# EAGLE board PMTHead (EAGLE 7.7.0)
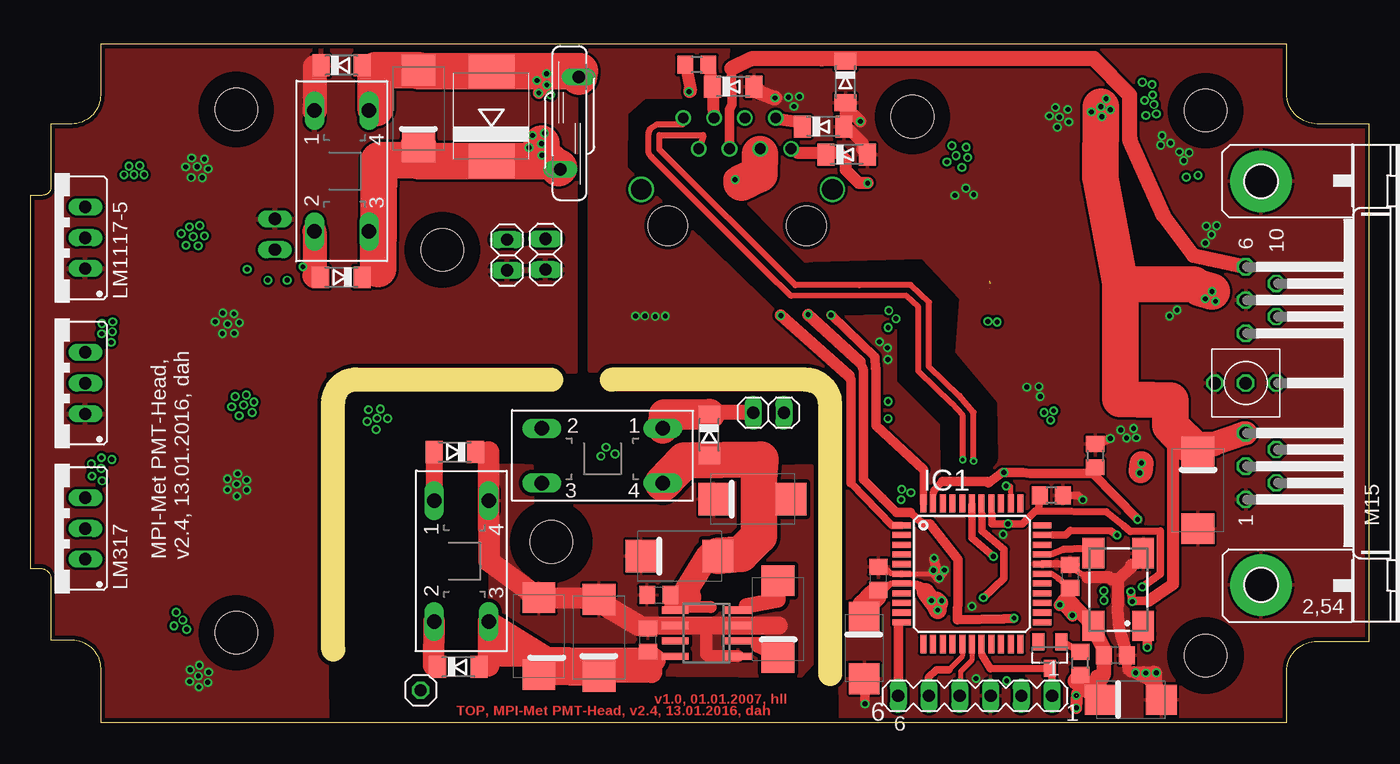
[diagram p4: board, top side]
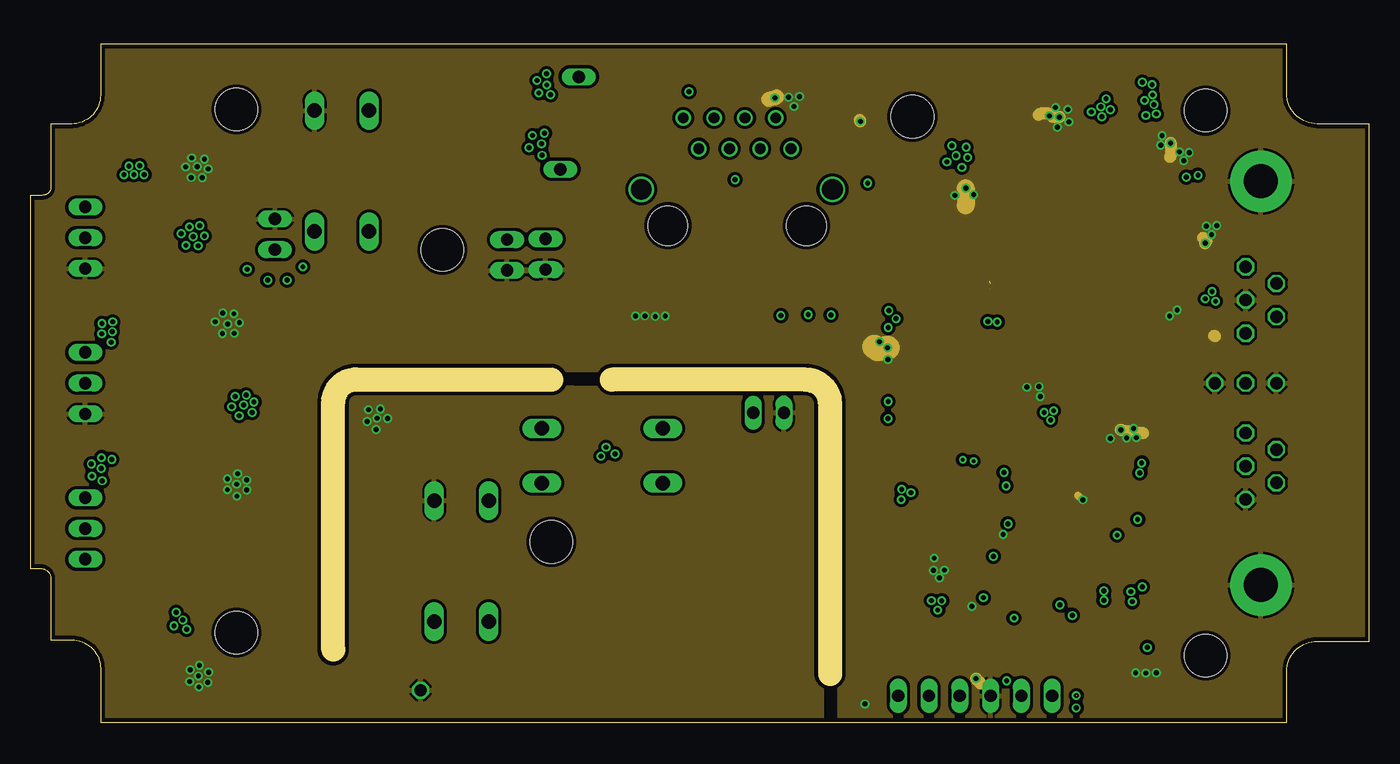
[diagram p5: board, inner layer layer_gnd]
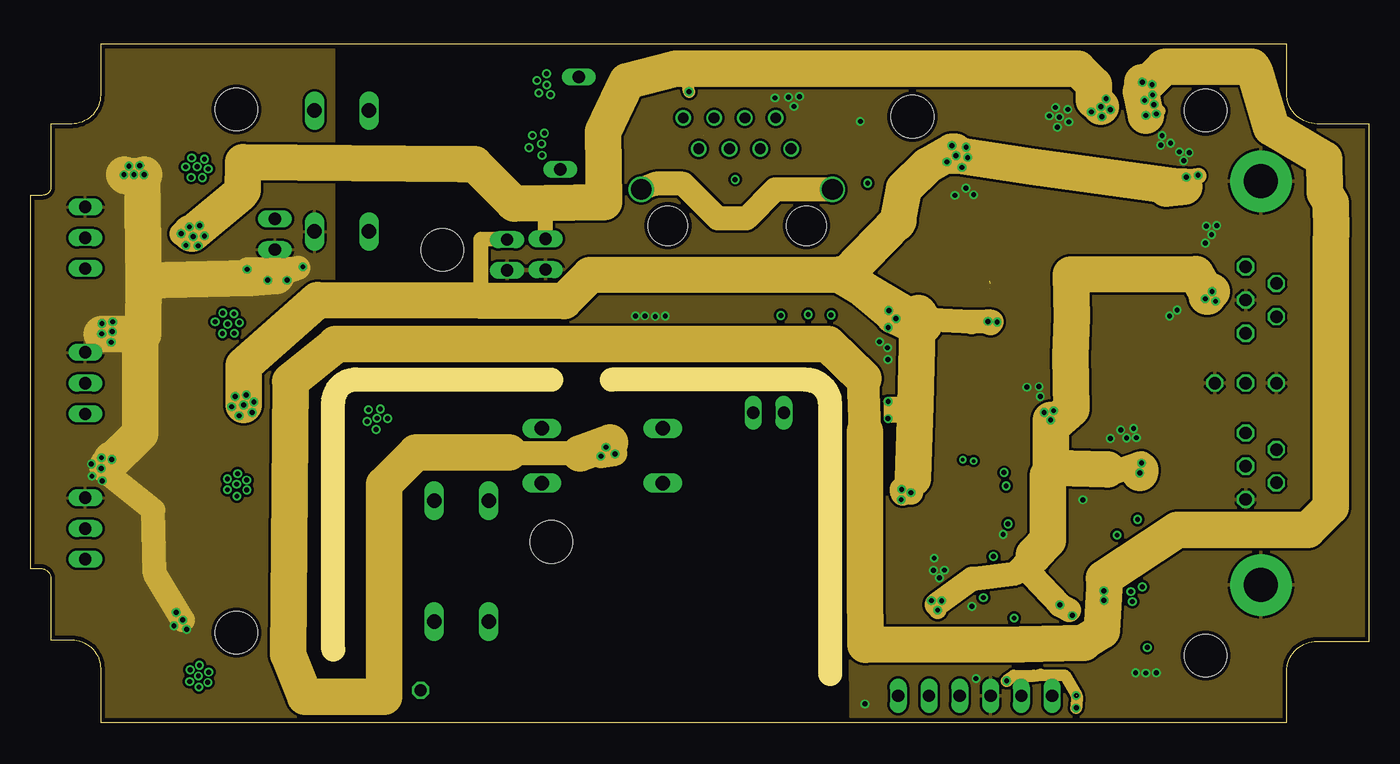
[diagram p6: board, inner layer layer_pwr]
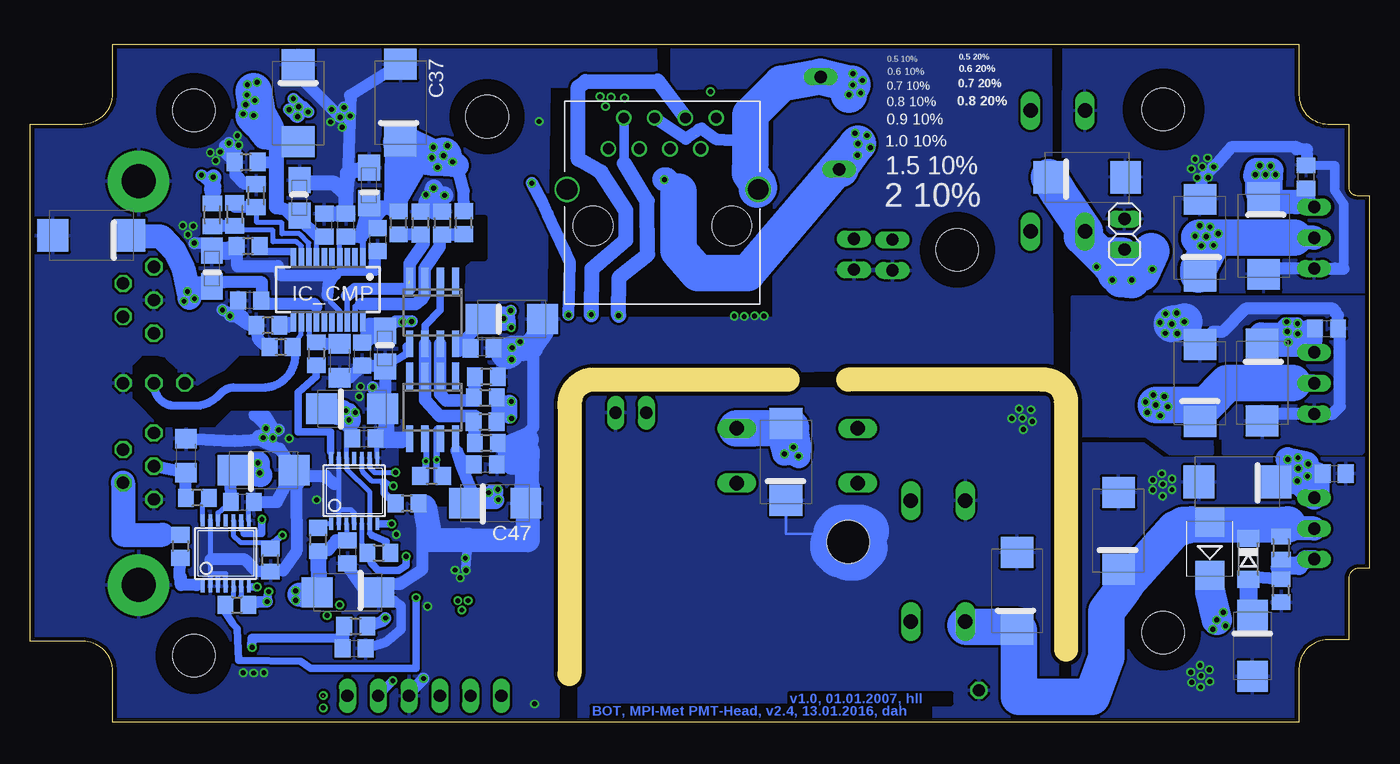
[diagram p7: board, bottom side, seen from below]

Size 110.5 x 56 mm. Coordinates in mm from the lower left corner, seen from the top.
Outline: 25,6 25,26.5 arc-90 27,28.3 43,28.3
Outline: 64.1,28.3 arc-90 66,26.1 66,4
Outline: 64,28.3 48,28.3
Outline: 0,43.5 0,12.7 0.9,12.7 arc-90 1.7,11.8 1.7,6.8 3.4,6.8 arc-90 5.8,4.4 5.8,0 103.7,0 103.7,4.2 arc-90 106.2,6.7 110.5,6.7 110.5,49.4 106.2,49.4 arc-90 103.7,51.9 103.7,56 5.8,56 5.8,51.8 arc-90 3.4,49.4 1.7,49.4 1.7,44.2 arc-90 1,43.5 0,43.5
Copper layers (1+2*15+16): Top 0.035mm / dielectric 0.38mm / layer_gnd 0.035mm / dielectric 0.71mm / layer_pwr 0.035mm / dielectric 0.38mm / Bottom 0.035mm
Design rules "PCB-POOL Standard_ML4": minimum track width 0.15mm, minimum drill 0.3mm, track to track 0.15mm, track to pad 0.15mm, pad to pad 0.15mm, via to via 0.15mm, smd to smd 0.15mm, copper to edge 0.3mm, drill to drill 0.2mm, minimum pad ring 0.2mm, minimum via ring 0.15mm, stop-mask expansion 0.075mm, vias tented up to drill 0mil, thermal gap 0.2mm
Net classes: 0 default: width 0.2 mm, clearance 0.205 mm; 1 power: width 1.4 mm, clearance 0.2 mm; 2 hpower: width 3 mm, clearance 0.2 mm
Holes 3.5 mm at 17,7.4 17,50.6 97,5.5 97,50.5 43,14.9 34,39 72.8,50
tRestrict: area 14,4.4 to 20,10.4; area 94,47.5 to 100,53.5; area 94,2.5 to 100,8.5; area 31,36 to 37,42; area 40,11.9 to 46,17.9; area 14,47.6 to 20,53.6; area 69.8,47 to 75.8,53
bRestrict: area 14,47.6 to 20,53.6; area 14,4.4 to 20,10.4; area 31,36 to 37,42; area 94,47.5 to 100,53.5; area 94,2.5 to 100,8.5; area 69.8,47 to 75.8,53; area 88.4,24.5 to 102,30.2; area 72.3,18 to 85.4,41.7

## Footprints (pad centres in the part's own frame; a part is rotated, then mirrored left to right if it is on the bottom)
D/7343-31R = smd 2.55 x 2.7: + 3.175,0; - -3.175,0
C0805 = smd 1.3 x 1.5: 1 -0.95,0; 2 0.95,0
A/3216-18W = smd 2.15 x 1.8: + 1.475,0; - -1.475,0
C/6032-28R = smd 2.55 x 2.5: + 2.525,0; - -2.525,0
C1206 = smd 1.6 x 1.8: 1 -1.4,0; 2 1.4,0
SMC = smd 2.8 x 3.8: A 3.7,0; C -3.7,0
SOD80C = smd 1.4 x 1.8: A 1.7,0; C -1.7,0
SMB = smd 2.4 x 2.4: A 2.2,0; C -2.2,0
MINIMELF = smd 1.4 x 1.8: A 1.7,0; C -1.7,0
SOT23 = smd 1 x 1.4: 1 -0.95,-1.1; 2 0.95,-1.1; 3 0,1.1
TQFP44 = smd 1.5 x 0.5: 1 -5.8,4; 2 -5.8,3.2; 3 -5.8,2.4; 4 -5.8,1.6; 5 -5.8,0.8; 6 -5.8,0; 7 -5.8,-0.8; 8 -5.8,-1.6; 9 -5.8,-2.4; 10 -5.8,-3.2; 11 -5.8,-4; 23 5.8,-4; 24 5.8,-3.2; 25 5.8,-2.4; 26 5.8,-1.6; 27 5.8,-0.8; 28 5.8,0; 29 5.8,0.8; 30 5.8,1.6; 31 5.8,2.4; 32 5.8,3.2; 33 5.8,4 | smd 0.5 x 1.5: 12 -4,-5.8; 13 -3.2,-5.8; 14 -2.4,-5.8; 15 -1.6,-5.8; 16 -0.8,-5.8; 17 0,-5.8; 18 0.8,-5.8; 19 1.6,-5.8; 20 2.4,-5.8; 21 3.2,-5.8; 22 4,-5.8; 34 4,5.8; 35 3.2,5.8; 36 2.4,5.8; 37 1.6,5.8; 38 0.8,5.8; 39 0,5.8; 40 -0.8,5.8; 41 -1.6,5.8; 42 -2.4,5.8; 43 -3.2,5.8; 44 -4,5.8
QSOP20 = smd 0.45 x 1.5: 1 -2.857,-2.69; 2 -2.223,-2.69; 3 -1.587,-2.69; 4 -0.953,-2.69; 5 -0.318,-2.69; 6 0.318,-2.69; 7 0.953,-2.69; 8 1.587,-2.69; 9 2.223,-2.69; 10 2.857,-2.69; 11 2.857,2.69; 12 2.223,2.69; 13 1.587,2.69; 14 0.953,2.69; 15 0.318,2.69; 16 -0.318,2.69; 17 -0.953,2.69; 18 -1.587,2.69; 19 -2.223,2.69; 20 -2.857,2.69
SOP08@1 = smd 0.6 x 2.2: 1 -1.905,-2.6; 2 -0.635,-2.6; 3 0.635,-2.6; 4 1.905,-2.6; 5 1.905,2.6; 6 0.635,2.6; 7 -0.635,2.6; 8 -1.905,2.6
TSSOP14 = smd 0.305 x 0.991: 1 -1.905,-2.718; 2 -1.27,-2.718; 3 -0.635,-2.718; 4 0,-2.718; 5 0.635,-2.718; 6 1.27,-2.718; 7 1.905,-2.718; 8 1.905,2.718; 9 1.27,2.718; 10 0.635,2.718; 11 0,2.718; 12 -0.635,2.718; 13 -1.27,2.718; 14 -1.905,2.718
82721K = drill 1.194 long: 1 -4.993,-2.254; 2 4.993,-2.254; 3 4.993,2.254; 4 -4.993,2.254
317TS = drill 1.016 long: 1 -2.54,-2.54; 2 0,-2.54; 3 2.54,-2.54
317TS' = drill 1.016 long: 1_GND -2.54,-2.54; 2_OUT 0,-2.54; 3_IN 2.54,-2.54
SOP08 = smd 0.6 x 2.2: 1 -1.905,-2.6; 2 -0.635,-2.6; 3 0.635,-2.6; 4 1.905,-2.6; 5 1.905,2.6; 6 0.635,2.6; 7 -0.635,2.6; 8 -1.905,2.6
MA06-1 = drill 1.016 long: 1 -6.35,0; 2 -3.81,0; 3 -1.27,0; 4 1.27,0; 5 3.81,0; 6 6.35,0
SM77H = smd 2.5 x 1.8: 1 -3,-2.05; 2 3,-2.05; 3 3,2.05; 4 -3,2.05
R0805 = smd 1.3 x 1.5: 1 -0.95,0; 2 0.95,0
S10K11 = drill 1.016 long: 1 -0.762,-3.81; 2 0.762,3.81
M0805 = smd 1.3 x 1.6: 1 -0.95,0; 2 0.95,0
CAT6 = drill 0.889: 1 -4.445,5.08; 2 -3.175,7.62; 3 -1.905,5.08; 4 -0.635,7.62; 5 0.635,5.08; 6 1.905,7.62; 7 3.175,5.08; 8 4.445,7.62 | drill 1.7: P$1 7.913,1.734; P$2 -7.862,1.721 | hole 3.251: -5.715,-1.27; 5.715,-1.27
1X01 = drill 1.016 octagon: 1 0,0
M15HP = drill 1.016 octagon: 1 -9.601,1.27; 2 -6.858,1.27; 3 -4.115,1.27; 4 4.115,1.27; 5 6.858,1.27; 6 9.601,1.27; 7 -8.23,-1.27; 8 -5.486,-1.27; 9 5.486,-1.27; 10 8.23,-1.27; COAX 0,1.27; COAX_GND1 0,3.81; COAX_GND2 0,-1.27 | drill 2.8 pad 5.08: G1 -16.662,0; G2 16.662,0
1X02 = drill 1.016 long: 1 -1.27,0; 2 1.27,0

## Placement (x,y rotation side)
C1  100uF  [D/7343-31R]  23.28,44.99 180 bottom
C2  100uF  [D/7343-31R]  32.05,50.67 270 top
C3  100nF  [C0805]  2.89,20.53 0 bottom
C4  100nF  [C0805]  72.94,21.3 180 bottom
C5  47uF  [D/7343-31R]  61.71,8.52 270 top
C6  100nF  [C0805]  5.21,45.03 90 bottom
C7  100uF  [D/7343-31R]  29.06,10.85 270 bottom
C8  100uF  [D/7343-31R]  8.71,40.16 90 bottom
C9  1uF  [A/3216-18W]  82.54,44.33 270 bottom
C10  1uF  [A/3216-18W]  81.22,30.85 90 bottom
C11  100uF  [D/7343-31R]  10.89,19.84 0 bottom
C12  100uF  [D/7343-31R]  20.69,15.81 270 bottom
C13  10uF  [C/6032-28R]  9.63,6.31 90 bottom
C14  100nF  [C0805]  3.53,32.51 0 bottom
C15  100uF  [D/7343-31R]  8.84,28.04 90 bottom
C16  100uF  [D/7343-31R]  13.97,28 270 bottom
C17  100uF  [D/7343-31R]  13.97,40 270 bottom
C18  100nF  [C0805]  50.98,6.79 90 top
C19  47uF  [D/7343-31R]  53.59,13.72 180 top
C20  100uF  [D/7343-31R]  59.61,18.43 180 top
C21  100uF  [D/7343-31R]  48.14,21.5 270 bottom
C22  47uF  [D/7343-31R]  46.94,6.99 270 top
C23  100uF  [D/7343-31R]  41.97,7.12 270 top
C24  100nF  [C0805]  51.86,10.51 0 top
C25  100nF  [C0805]  89.54,5.52 180 top
C26  820nF  [C1206]  97.65,22.02 90 bottom
C27  100nF  [C0805]  85.81,12.05 270 top
C28  100nF  [C0805]  70,11.89 90 top
C29  100nF  [C0805]  93,18.2 0 bottom
C30  100nF  [C0805]  84.33,14.07 270 bottom
C31  100nF  [C0805]  82.96,23.43 0 bottom
C32  10nF  [C0805]  83.11,30.41 270 bottom
C33  10nF  [C0805]  81.83,39.85 270 bottom
C34  10nF  [C0805]  84.45,41.05 90 bottom
C35  10nF  [C0805]  86.23,41.04 90 bottom
C36  10nF  [C0805]  92.39,34.83 180 bottom
C37  100uF  [D/7343-31R]  79.95,51.15 270 bottom
C38  10uF  [C/6032-28R]  91.25,20.82 180 bottom
C39  10uF  [C/6032-28R]  83.94,25.88 180 bottom
C40  10uF  [C/6032-28R]  84.29,10.73 0 bottom
C41  10uF  [C/6032-28R]  90.82,1.86 180 top
C42  10uF  [C/6032-28R]  68.83,6.13 90 top
C43  100uF  [D/7343-31R]  88.39,51.11 90 bottom
C44  1uF  [A/3216-18W]  95.51,37.47 270 bottom
C45  1uF  [A/3216-18W]  88.28,43.29 90 bottom
C46  10uF  [C/6032-28R]  70.76,33.29 180 bottom
C47  10uF  [C/6032-28R]  72.13,18.09 180 bottom
C48  100nF  [C0805]  73.22,30.88 180 bottom
C49  100uF  [D/7343-31R]  105.46,40.2 0 bottom
C50  100uF  [D/7343-31R]  96.36,19.16 90 top
C51  100nF  [C0805]  83.78,6.11 0 bottom
COLP  820nF  [C1206]  84.98,29.84 270 bottom
D2  [SMC]  38.06,50.03 90 top
D3  [SOD80C]  25.67,36.74 180 top
D4  [SOD80C]  25.69,54.24 0 top
D5  [SMB]  13.15,14.32 90 bottom
D6  5.6V  [MINIMELF]  65.43,49.18 0 top
D7  [SOD80C]  35.33,4.58 0 top
D8  [SOD80C]  35.04,22.32 180 top
D9  [SOD80C]  56.03,23.73 270 top
D10  [SOT23]  84.14,5.56 180 top
D11  [SOD80C]  9.98,13.49 270 bottom
D12  5.6V  [MINIMELF]  67.38,46.87 0 top
D13  5.6V  [MINIMELF]  67.28,52.86 270 top
D14  5.6V  [MINIMELF]  58.01,52.48 0 top
IC1  PIC16F877PT  [TQFP44]  77.71,12.26 0 top
IC_CMP  [QSOP20]  85.92,35.72 180 bottom
IC_DRV  SN65LVDS100  [SOP08@1]  77.3,26.01 180 bottom
IC_FLIP  MC100LVEL51  [SOP08@1]  77.3,33.84 180 bottom
IC_R2_GAIN  100k  [TSSOP14]  94.37,13.94 0 bottom
IC_R2_OFFS  10k  [TSSOP14]  83.77,19.11 0 bottom
L1  CMC_1MH_2A_45MOHM  [82721K]  25.7,45.51 270 top
L2  CMC_1MH_2A_45MOHM  [82721K]  35.59,13.32 270 top
L3  CMC_1MH_2A_45MOHM  [82721K]  47.22,22.01 180 top
LM317  5.3V  [317TS]  2,16 90 top
LM1117-3.3  3.3V  [317TS']  2,28 90 top
LM1117-5  5.0V  [317TS']  2,40 90 top
LM2663  lm2663  [SOP08]  55.82,7.36 90 top
PROGRAMMIER_INTERFACE  [MA06-1]  77.98,2.19 180 top
QC1  5V 20MHz  [SM77H]  89.79,10.96 90 top
R1  470  [R0805]  86.65,4.88 90 top
R1_GAIN  10k  [R0805]  98.11,14.53 270 bottom
R1_OFFS  2M2  [R0805]  86.74,15.09 90 bottom
R2  10k  [R0805]  90.68,13.39 90 bottom
R3  4k7  [R0805]  92.69,46.26 0 bottom
R4  82.5  [R0805]  76.51,41.21 270 bottom
R5  200k  [R0805]  90.89,32.77 180 bottom
R6  390  [R0805]  96.71,18.53 180 bottom
R7  82.5  [R0805]  78.3,41.22 270 bottom
R8  127  [R0805]  80.1,41.23 90 bottom
R9  127  [R0805]  74.72,41.25 90 bottom
R10  82.5  [R0805]  72.87,23.05 180 bottom
R11  82.5  [R0805]  72.87,28.53 180 bottom
R12  127  [R0805]  72.97,24.81 0 bottom
R13  127  [R0805]  72.94,26.81 0 bottom
R14  4k7  [R0805]  92.52,39.32 0 bottom
R15  10k  [R0805]  79.41,18.07 180 bottom
R16  S10K11  [S10K11]  44.51,49.47 0 top
R17  100  [R0805]  77.37,20.35 0 bottom
R19  120  [M0805]  7.29,14.39 90 bottom
R20  390  [R0805]  7.27,10.87 90 bottom
R27  1k  [M0805]  95.47,41.9 270 bottom
R28  1k  [M0805]  93.63,41.93 90 bottom
R29  1k  [M0805]  91.87,43.49 90 bottom
R35  470  [R0805]  83.64,7.94 0 bottom
R_CS0  4k7  [R0805]  93.45,9.7 0 bottom
R_CS1  4k7  [R0805]  81.73,13.99 0 bottom
R_P1  4k7  [R0805]  87.88,22.02 270 top
R_P2  4k7  [R0805]  84.27,18.74 180 top
R_P3  4k7  [R0805]  55.01,54.29 180 top
R_TERM  49.9  [R0805]  89.8,30.99 0 bottom
RJ45  [CAT6]  58.34,42.27 0 bottom
ROLP  100  [R0805]  86.89,30.43 270 bottom
SHIELDG  [1X01]  32.21,2.65 0 top
SUBD  [M15HP]  101.57,28 90 top
TP_12V  [1X02]  20.2,40.29 270 bottom
TP_+3.3V  [1X02]  39.35,38.58 90 top
TP_+5V  [1X02]  42.52,38.64 90 top
TP_-5V  [1X02]  60.93,25.56 180 top

## Tracks (layer width: path | path; a pad name or v marks a point on that pad's centre or on a via)
12V_VON_DAQ  (via drill 0.4)
  Top 1: 28.7,37.4 28.02,37.4 D3.C | 28.79,46.42 28.05,40.6 L1.3 | v42.19,47.76 42.19,48.39 v42.43,48.63 41.62,48.63 v41.44,48.45 41.44,47.72 v41.16,47.44 | 42.19,46.98 42.19,46.86 v42.24,46.81
  Top 2: RJ45.3 60.2,46.91 | 58.7,44.54 58.3,44.76 v58.17,44.81
  Top 3: 28.7,37.4 28.79,46.42 32.09,46.42 32,47.5 C2.+ 32.05,46.33 D2.C 42.84,46.33 | 42.84,46.33 43.61,45.73 43.62,45.78 | v42.19,47.76 42.19,46.98 42.84,46.33 | 60.2,46.91 60.17,45.24 59.15,44.74 58.7,44.54
  Bottom 2: v58.17,44.81 58,44.81 57.02,43.83
  Bottom 3: 43.65,45.66 R16.1 42.3,47.65 v42.19,47.76 51.3,37.09 55.4,37.09 57.02,38.96 57.02,43.83
+3V3  (via drill 0.4)
  layer_pwr 0.5: 76.07,47.1 v76.07,47.6 | v75.65,46.26 75.65,45.62 75.55,45.52 76.2,45.52 76.2,45.53 76.6,45.53 v76.88,45.81 | 71.24,33.58 71.43,33.87 v70.85,33.99
  layer_pwr 0.635: 72.84,20.14 72.92,20.12 72.92,20 | v76.4,46.79 76.42,46.79 76.42,46.84
  layer_pwr 0.7: 73.57,26.5 70.8,26.51 v70.78,25.06 72.4,25.07 72.4,25.67 71.23,25.67 71.27,26.43 73.74,26.43 73.06,26.19
  layer_pwr 0.8: v70.8,26.48 73.57,26.5
  layer_pwr 1.25: TP_+3.3V.2 37.18,39.87 37.15,34.82
  layer_pwr 1.3: v95.4,45 96.4,45.12 94.57,44.22
  layer_pwr 2: 71.24,33.58 70.8,33.37 v71.45,33.32 | 79.08,33.01 79.26,32.93 v79.03,33.1 79.33,33.08 77.71,33.03 73.64,33.27 | v72.68,18.96 72.64,19.72 72.92,20 71.98,18.87 v71.92,19.24
  layer_pwr 3: v17.6,26.2 17.62,29.45 23.71,34.84 37.15,34.82 44.04,34.77 46.21,36.94 66.74,36.98 73.76,32.79 | 73.76,32.79 73.2,32.64 | 73.2,32.64 71.24,33.58 | 72.84,20.14 73.06,26.19 73.2,32.64 | v70.85,33.99 67.31,36.98 71.66,41.4 71.38,41.11 71.57,41.26 72.12,44.06 74.03,45.97 76.07,47.1 76.02,47.07 76.3,47.11 v76.4,46.79 | 94.57,44.22 95.24,44.22 93.77,44.04 94.93,44.17 82.67,45.86 76.42,46.84 76.17,46.88 | 73.64,33.27 73.28,33.8 C46.+ 73.76,32.81 73.76,32.79
  Bottom 0.4: IC_CMP.4 84.97,39.58 C34.1 | IC_CMP.1 83.06,38.68 83.06,38.96 83.08,39.07 83.05,39.21 | 83.05,39.88 C33.1 | IC_CMP.20 83.06,31.48 82.54,31.54 | IC_FLIP.8 74.99,31.24 74.99,31.45 74.98,31.24 74.97,30.56 74.99,30.39 74.65,30.53 C48.2
  Bottom 0.5: 83.05,39.21 83.05,39.88 | C4.2 75.42,22.35 IC_DRV.8 | 76.64,46.61 76.64,46.05 v76.88,45.81 | 77.29,46.61 77.34,46.61 v77.36,46.63 77.36,47.35 v77.23,47.48 | v71.45,33.32 70.79,33.16 | v70.79,25.07 70.8,25.09 70.95,25.32
  Bottom 0.63: 72.11,18.34 71.97,19.16
  Bottom 0.635: 75.28,45.97 76.88,45.97 v76.88,45.81 | v79.8,33.04 80.41,33.04 80.41,33.02
  Bottom 0.7: 70.79,33.16 v70.8,32.59
  Bottom 0.8: 83,40.47 82.74,41.27
  Bottom 1: C16.+ 13.97,25.93 13.7,26.2 | C32.1 82.54,31.54 82.54,32.9 81.25,32.88 C10.+ 80.41,33.02 80.31,33.1 v79.03,33.1 | C9.+ 83.14,40.63 83.18,40 | 83.18,40 83.7,40.06 C34.1 | 83.18,40 83,40.47 | 82.74,41.27 82.83,40.82 C33.1 | C46.+ 73.28,32.94 74.98,31.24 | C47.+ 74.07,19.13 74.98,21.39 75.33,22.43 75.29,22.37 74.89,21.41 C4.2 | R9.2 74.74,43.88 75.28,45.97 | 77.83,46.18 80.15,43.82 | R12.2 71.87,26.83 R13.2 | 70.98,26.35 v70.8,26.48 | v18.31,25.57 18.23,25.57 v17.6,26.2 | v16.61,26.05 16.63,26.05 | 16.74,26.05 16.85,26.05 v17.83,27.03 17.83,26.43 | 17.83,26.43 v17.6,26.2 | 17.83,26.43 17.12,26.43 16.74,26.05 | 16.74,26.05 16.63,26.05 | 16.63,26.05 16.55,25.97 16.57,25.97 v17.23,25.31 | v16.9,26.9 18.01,26.9 | 18.01,26.9 v18.46,26.45 | 18.01,26.9 18.01,26.61 v17.6,26.2 | 71.47,33.37 v70.85,33.99 | v96.37,45.16 95.24,44.24 95.21,43.83 95.47,43.83 R27.1 | 71.97,19.16 72.03,18.53 v71.88,18.38 | 72.11,18.34 72.44,19.1 v72.68,18.96
  Bottom 1.25: 80.25,47.36 C37.+ 78.72,47.37 79.99,44.4 80.15,43.82 78.62,45.41 80.07,42.9 R8.2 | 80.34,42.59 81.47,42.46 82.28,41.57 82.3,40.85 82.74,41.27
  Bottom 1.3: 95.47,43.83 v95.4,45 | 73.2,33.37 C46.+ | R13.2 71.96,26.79 70.95,25.32 70.96,26.37 70.98,26.35
  Bottom 1.4: LM1117-3.3.2_OUT 6.3,28 7,28
  Bottom 1.5: C47.+ 74.36,18.34 72.11,18.34
  Bottom 2: 80.25,47.36 80.34,42.59 | 75.28,45.97 77.83,46.18 | 73.2,33.37 71.5,33.37 v71.45,33.32
  Bottom 3: 6.3,28 11.7,28 13.5,26.2 13.7,26.2 v17.6,26.2 | v76.4,46.79 76.64,46.61 77.29,46.61 79.89,47.86
+5V  (via drill 0.4)  (1 unrouted)
  Top 0.5: 69.68,10.47 70.03,10.47 | 70.03,10.47 71.02,11.46 IC1.7 73.18,11.46 73.41,11.23 | 86.37,3.41 86.83,3.46 86.62,3.68 R1.1 | C27.2 84.84,11.88 84.26,12.26 IC1.28 | 70.03,10.47 70.03,10.91 C28.1 | 74.99,9.85 74.99,9.36 v74.89,9.26 | 85.3,10.14 85.64,10.14 | 90.05,35.77 90.05,35.67 89.95,36.18 | 96.02,36.15 95.8,35.07 v96.96,34.96
  Top 0.635: 94.3,23.11 94.67,23.11 94.67,23.91
  Top 0.7: 90.86,10.81 90.91,9.96 v90.96,9.96 90.96,10.03 92.32,10.03
  Top 0.8: 73.41,11.23 73.41,11.15 73.9,10.74
  Top 1: 94.3,23.11 94.3,11.39 92.32,10.03 | v84.97,9.69 85.3,10.14 85.3,9.66 v86.01,8.82 | 85.64,10.14 C27.2 | v86.32,1.19 86.4,2.36 88.59,4 | R_P3.2 54.51,52.1 54.41,52.04 54.47,52.47 v54.37,52.06
  Top 1.2: 86.83,3.46 87.25,3.02 87.92,3.2 88.05,3.77 88.36,3.51 88.59,4 C25.2 88.59,6.03 87.88,7.49 87.56,7.39 87.56,7.6 87.71,7.78 QC1.4 85.64,10.14
  Top 1.5: 73.9,10.74 74.6,9.78 v74.89,9.26 | C41.+ 87.14,2.88 86.37,3.41 | v74.37,10.05 74.8,10.05 74.99,9.85
  Top 2: 91.66,20.94 91.64,20.75 v91.72,21.4 | 95.61,22.97 95.92,22.97 C50.+ 96.8,22.97 97.68,22.97 100.19,23.86 SUBD.3 | C42.+ 68.83,9.62 69.68,10.47
  Top 3: v88.35,50.81 88.33,44.95 90.05,35.77 | 96.53,35.84 v97.53,35.56 | 96.02,36.15 89.95,36.18 89.95,26.69 94.07,26.55 94.07,24.51 94.67,23.91 95.61,22.97
  layer_pwr 0.5: v83.67,25.57 83.78,25.46 84.32,25.46 84.32,25.59 v84.45,25.72 | 74.81,9.72 74.9,9.72 v75.22,10.04
  layer_pwr 1: v80.58,3.42 80.67,3.46 80.6,3.46 81.14,3.85 82.81,3.85 83.4,3.93 85.37,3.87 86.37,2.19 v86.32,1.19 | v54.37,52.06 53.94,54.81 53.94,53.95
  layer_pwr 1.25: TP_+5V.2 42.54,42.69 39.98,42.84
  layer_pwr 1.5: v74.89,9.26 74.81,9.72
  layer_pwr 2: 84.32,25.46 84.29,25 84.26,25 | v91.72,21.4 89.15,20.5 88.88,20.89 | v12.46,40.34 13.18,40.34 13.24,40.4 | v13.45,40.1 13.36,40.41 13.3,40.36 | 74.81,9.72 77.72,11.86 81.32,12.3 81.94,12.91 | 81.94,12.91 82.82,13.8 | 85.72,9.27 v84.97,9.69 81.94,12.91
  layer_pwr 3: 13.38,40.34 13.3,40.36 13.24,40.4 13.34,40.34 17.26,43.59 17.54,43.93 17.58,46.24 35.49,46.09 36.67,46.09 39.85,42.91 39.98,42.84 47.33,42.94 47.28,48.76 49.23,52.91 53.24,53.95 53.94,53.95 86.46,53.95 87.79,52.62 87.79,51.37 v88.35,50.81 | v97.53,35.56 97.27,35.33 97.11,35.13 97.18,35.17 97.13,35.36 96.21,37 85.89,36.95 85.95,33.4 85.82,30.28 85.91,25.88 84.28,24.41 v84.21,24.95 84.23,20.99 84.61,20.98 | 88.88,20.89 84.61,20.98 | v91.56,20.58 91.62,20.84 | 82.82,13.8 82.82,13.82 84,15 84,20.38 84.61,20.98
  Bottom 0.4: 84.41,23.14 IC_R2_OFFS.12 84.41,20.93 82.5,19.05 IC_R2_OFFS.6 82.5,15.59 82.27,15.45 | 84.41,23.14 C31.1 | IC_CMP.14 86.87,34.1 86.87,33.94 | IC_R2_GAIN.12 95,17.3 C29.1 94.08,18.07 | IC_R2_GAIN.6 93.1,10.4 R_CS0.2 | 84.41,23.14 84.41,24.84 v83.67,25.57
  Bottom 0.5: v96.95,34.95 v97.82,34.76 | v96.96,34.96 97.13,34.97 96.89,35.1 | 91.51,20.41 90.97,20.59 v91.56,20.58
  Bottom 0.6: 82.27,15.45 81.12,14.93 81,13.67 R_CS1.2 | 86.87,33.94 86.86,34.39 86.89,34.3
  Bottom 0.7: v90.83,10.79 90.87,10.79 v90.96,9.96
  Bottom 0.8: PROGRAMMIER_INTERFACE.2 v80.58,3.42
  Bottom 1: 91.35,35.39 C36.1 90.67,34.53 87.07,34.53 86.89,34.35 86.89,34.3 | 91.35,35.39 91.27,35.08 | 91.35,35.39 91.37,36.33 94.53,36.33 97.04,36.32 v96.95,34.95 | 86.27,25.88 C39.+ | v96.95,34.95 97.36,35.06 96.89,35.1 | C31.1 84.1,25.85 84.23,25.28 | 94.08,18.07 93.93,18.19 93.97,20.11 C38.+ | C44.+ 95.32,35.8 v97.53,35.56 97.03,34.87 v96.95,34.95 | v88.35,50.81 88.35,50.08 v88.44,49.99 | v88.35,50.81 87.98,50.81 v87.56,50.39 | v88.35,50.81 88.35,50.11 88.44,50.02 88.58,50.02 v89.14,50.58 | v88.35,50.81 88.35,51.03 v88.79,51.47 | v13.13,40.9 13.13,40.42 v13.45,40.1 13.97,40.62 v13.97,41 | v90.96,9.96 92.5,9.87 R_CS0.2
  Bottom 2: LM1117-5.2_OUT 6.2,40 | C39.+ 84.23,25.28 | 85.86,25.89 84.23,25.28 | 84.23,25.28 v84.21,24.95 84.8,25.62 | C38.+ 91.51,20.41 91.67,20.66 v91.72,21.4 | 97.36,35.06 97.86,37.4 98.64,38.99 99.66,40.09 101.69,40.09 C49.+ | 14.02,40.02 13.51,40.05 | 13.51,40.05 v12.84,39.38 | 14.1,36.95 C17.+ | 13.51,40.05 13.51,40.28 v13.45,40.1 | 14.02,40.02 14.53,39.87 v13.85,39.34 | 14.02,40.02 14.53,40.14 v14.37,40.15
  Bottom 3: 6.2,40 14.02,40.02 13.32,39.32 13.22,39.08 14.1,37.4 14.1,36.95
  other vias: 86.32,2.21
+15V  (via drill 0.4)
  Top 1: 23.5,36.8 23.91,36.8 D3.A
  Top 2: L1.2 23.45,36.85 23.5,36.8
  layer_pwr 0.5: 20.31,36.83 20.02,36.83 19.93,36.92 20.78,36.92 v21.2,36.5 | 22.11,37.5 22.4,37.5 v22.5,37.6
  layer_pwr 2: v12.59,8.45 10.27,12.29 10.15,17.53 v5.86,20.96 | v17.9,37.4 22.11,37.5 20.31,36.83
  layer_pwr 3: 20.31,36.83 18.19,36.69 9.35,36.48 | 9.35,36.48 9.25,45.07 | v5.89,32.07 9.31,32.06 9.32,32.73 | 9.32,32.73 9.35,36.48 | 9.25,45.07 v9.39,45.21 | 9.25,45.07 7.86,45.07 v7.73,45.2 | v6.73,21.71 6.44,21.23 9.05,23.84 9.05,32.46 9.32,32.73
  Bottom 0.5: 6.93,32.93 6.93,32.46 | 6.93,32.46 6.93,32.41 v6.77,32.25 | v6.8,33.06 6.8,32.59 6.93,32.46 | v21.2,36.5 21.2,36.7 20.9,37 | 9.25,43.84 9.36,43.84 9.41,43.78 | v5.88,21.85 5.56,21.85 v5.04,21.33 5.07,21.3 5.12,21.3 5.2,21.3 5.31,21.41 | v5.09,20.32 5.09,20.61 5.28,20.8 | v5.86,20.96 5.71,20.96 5.5,20.75 | 6.06,19.84 6.06,19.92 5.81,20.17 | v12.04,9.08 12.04,9 v12.59,8.45 | v12.59,8.45 12.35,8.45 v11.86,7.96 | v12.59,8.45 12.59,8 v12.91,7.68
  Bottom 1: C3.1 4.27,20.53 4.3,20.5 | LM1117-5.3_IN 6.39,42.56 5.36,42.99 | LM1117-3.3.3_IN 4.54,31.27 4.84,31.57 | 4.84,32.07 5.05,32.07 v5.91,32.93 6.93,32.93 7.05,32.81 6.67,32.43 v6.67,31.38 | C6.1 5.21,43.51 5.77,42.95 | C8.+ 9.58,43.62 9.41,43.78 9.26,43.93 9.26,44.46 | 9.26,44.46 9.26,44.5 v8.55,45.21 | v8.14,45.92 8.14,45.43 8.09,45.38 | v9.03,45.96 9.03,45.86 9.29,45.6 | 9.26,44.46 8.65,45.07 | C14.1 5.45,32.51 v5.89,32.07
  Bottom 2: v5.93,19.94 5.81,20.17 5.5,20.75 5.17,21.36 5.12,21.3 5.28,20.8 | v6.73,21.71 5.31,21.41 5.3,21.4 | D5.C 13.13,10.68 | L1.2 21.96,39.02 TP_12V.2 20.2,37.8 | 4.3,20.5 4.3,18.78 LM317.3 5.7,19.7 5.7,20.2 6.06,19.84 C11.+ | C15.+ 9.07,31.38 | 9.07,31.38 8.94,32.02 v5.89,32.07 | 5.36,42.99 5.77,42.95 6.03,42.93 7.49,42.93 8.16,43.01 | v9.39,45.21 9.25,45.07 9.25,43.84 8.98,43.06 8.16,43.01 | 8.16,43.01 8.09,45.38 8.08,45.6 9.29,45.6 9.43,45.12 | 4.84,31.57 4.84,32.07 5.01,32.24 5.01,31.56 5.44,31.13 8.83,31.13 9.07,31.38
  Bottom 2.5: 13.13,10.68 v12.59,8.45
  Bottom 3: L1.2 25.57,43.59 C1.+ | 20.2,37.8 21.4,37.8 23.7,40.1 | 20.2,37.8 18.8,37.1 18,38.9 v19.6,36.5 20.5,36.6 20.9,37 19.7,36.9
  pour layer_pwr: -0.07,56.34 25.03,56.34 25.03,30.04 23.14,28.15 23.43,0 -0.4,-0.3
-5V  (via drill 0.4)
  Top 1.25: TP_-5V.2 56.16,25.56 D9.C
  Top 2.54: D9.C 52.31,25.38 L3.1
  layer_pwr 0.5: v88.6,10.86 88.67,10.93 88.67,11.76 88.62,11.81 88.62,11.87
  layer_pwr 1: v88.6,10.86 86.97,6.58 | 91.66,52.05 91.66,52.2 91.86,52.4 | v92.74,51 93.18,50.46 v92.94,50.22 92.19,50.22 v92.07,50.1
  layer_pwr 2: v47.09,21.97 v48.26,22.16 | 45.39,22.2 39.58,22.2 39.5,22.28
  layer_pwr 2.7: 68.88,24 68.71,28.36 68.75,28.4
  layer_pwr 3: v47.52,22.71 47.86,23.09 45.39,22.2 | 39.5,22.28 31.85,22.28 29.2,19.63 29.2,2.1 22.7,2.1 21.3,5.6 21.47,28.14 21.46,28.14 25.22,31.2 25.17,31.15 25.22,31.22 65.85,31.22 68.75,28.4 | v92.07,50.1 91.66,52.05 | v91.77,52.84 91.86,52.4 93.5,54.04 93.69,54.13 | 93.69,54.13 100.81,54.11 101.04,53.7 102.4,49.08 106.8,46.49 106.83,43.73 107.33,42.88 107.36,40.45 107.32,39.73 107.32,17.78 105.42,15.88 94.66,15.88 88.62,11.87 | 93.54,54.03 93.69,54.13 | 86.97,6.58 81.85,6.45 68.94,6.38 68.9,11.51 68.88,24 | 88.67,11.76 88.43,7.54 87.07,6.7
  Bottom 0.4: IC_CMP.7 86.87,39.94 C35.1 | IC_R2_OFFS.3 84.41,15.04 C30.1
  Bottom 0.5: v88.61,10.06 88.49,10.06 88.03,10.52 | 87.72,10.6 87.88,10.6 88,10.72
  Bottom 1: 47.75,23.9 C21.- 47.98,25.23 48.1,24.43 | C35.1 86.36,40.01 86.82,40.18 88.19,41.5 C45.- 88.95,41.81 89.54,42.4 89.85,42.4 90.17,42.57 | 87.15,10.2 87.08,10.47 C40.- | v88.6,10.86 88,10.72 87.61,10.63 87.15,10.2 | 87.15,10.2 88.36,10.75 | 90.17,48.24 87.79,48.22 | 87.79,48.22 87.59,48.42 | C30.1 85.27,15.02 85.89,14.23 86.81,14.22 R1_OFFS.1 | R3.2 90.39,46.26 90.17,46.48 | v91.77,52.84 92.53,52.83 v92.58,52.65 | 92.05,52.1 91.68,51.62 v91.96,51.34 92.41,51.79 v92.62,51.79 | 88.3,47.72 88.29,47.72 87.79,48.22
  Bottom 1.25: 90.17,42.57 90.17,46.48 90.17,48.24 | 88.3,47.72 C43.-
  Bottom 1.3: R1_OFFS.1 86.72,10.76
  Bottom 2: 47.45,24.18 v47.09,21.97 | v48.26,22.16 48.95,24.78 48.1,24.43 47.71,24.34 | 47.69,23.61 47.75,23.9 | 88.3,10.54 87.72,10.6 88.03,10.52 | 88.3,47.72 91.19,48.29 91.04,48.93 | 91.52,49.85 92.05,52.1 | 86.72,10.76 C40.-
  Bottom 3: 47.71,24.34 50.86,24.25 L3.1 | 47.69,23.61 v47.52,22.71 | 91.04,48.93 91.52,49.85 | 92.05,52.1 91.66,49.61 v92.07,50.1
CMP_OUT1
  Bottom 0.204: 83.23,34.55 83.18,34.55
  Bottom 0.4: 78.03,35.16 77.95,35.32 | 77.95,36.48 IC_FLIP.3
  Bottom 0.45: 83.41,34.55 83.7,34.34 83.7,33.11 IC_CMP.19
  Bottom 0.5: 83.23,34.55 83.41,34.55
  Bottom 0.6: 77.94,37.42 77.95,37.47
  Bottom 0.7: 83.31,34.62 83.23,34.55
  Bottom 1: 74.61,40.27 R9.1
  Bottom 1.029: 83.18,34.55 78.68,34.55 78.17,34.96 | 77.95,35.32 77.95,36.13 77.95,36.48 77.95,37.42 77.94,37.42 | 77.95,37.47 76.74,39.27 76.74,40.24 | R4.2 74.61,40.27
  Bottom 1.05: 78.17,34.96 78.03,35.16 | 76.74,40.24 R4.2
  pour Bottom: 83.28,34.12 83.45,33.99 83.57,33.83 83.61,33.75 83.59,33.62 83.62,33.56 83.76,33.53 83.81,33.61 83.74,34.53 83.48,34.88 83.45,34.88 83.12,34.55
CMP_OUT2  (2 unrouted)
  Bottom 0.4: 79.2,35.79 79.39,35.79 79.26,36.01 79.23,36.22
  Bottom 0.45: 84.33,35.23 IC_CMP.18
  Bottom 0.6: 79.2,37.76 79.18,37.89 | 78.07,40.07 79.69,40.48 79.77,40.29
  Bottom 1: 79.77,40.29 R8.1
  Bottom 1.029: 84.33,35.23 83.69,35.78 79.2,35.79 | R7.2 79.77,40.29 | 79.19,35.8 79.2,37.76 | 79.18,37.89 78.06,39.52 78.07,40.07
  pour Bottom: 84.35,34.05 84.68,35.37 83.95,35.21 84.4,34.36
CS0  (via drill 0.4)
  Top 0.4: 78.53,17.18 IC1.38
  Top 0.6: v78.66,10.29 80.34,11.9 80.37,14.28 78.53,15.82 78.53,17.18
  Bottom 0.4: IC_R2_GAIN.5 93.75,10.38 R_CS0.1 94.44,9.17
  Bottom 0.6: 94.44,9.17 93.78,8.17 93.42,7.7 93.41,7.71 93.31,5.12 88.17,5.03 87.38,4.45 78.67,4.45 78.66,8.73 v78.66,10.29
CS1  (via drill 0.4)
  Top 0.5: IC1.39 77.71,18
  Top 0.6: v79.49,13.69 77.71,15.21 77.71,18
  Bottom 0.4: IC_R2_OFFS.5 83.14,14.8 R_CS1.1
  Bottom 0.6: R_CS1.1 82.68,14.02 82.33,13.11 81.8,12.56 80.11,12.56 79.48,12.96 v79.49,13.69
DCDC_GND
  Top 0.61: 55.95,5.46 55.8,5.6
  Top 0.813: 50.94,8 C18.2 51.18,7.85
  Top 1: D8.C 37.84,22.33 | LM2663.1 55.95,5.46 | 55.8,5.6 55.8,7.47 | 55.8,7.47 55.8,8 | 61.77,8 61.8,7.97 58.45,7.97 | 58.45,7.97 LM2663.3 | 58.45,7.97 56.3,7.97 55.8,7.47
  Top 1.4: 51.18,7.85 50.2,7.99
  Top 1.5: 50.94,8 LM2663.6 LM2663.3 61.77,8
  Top 1.778: 37.84,22.33 L2.4 37.88,13.3 C23.- 47.04,10.21 C22.- 47.07,10.1 46.99,9.9 50.2,7.99
  pour Top (isolate 0.305): 38.1,21.2 37.77,5.77 37.92,4.01 63.66,3.8 64.56,4.79 64.54,21.2 54.39,20.92 52.28,17.89 43.75,17.88 41.51,17.66 41.44,21.17 40.05,21.23
DCDC_VCC
  Top 0.3: LM2663.8 51.85,5.46 51.46,5.13
  Top 1: D7.A 37.84,4.68 | 51.2,5.3 51.2,5.31 51.2,5.62 C18.1
  Top 1.778: 37.84,4.68 L2.3 42.83,5.25 41.39,6.08 38.11,6.23 38.85,5.49 41.92,5.49 C23.+ 46.84,3.87 C22.+ 46.99,4.16 51.26,4.12 51.2,5.31 42.23,5.3
  Top 2: 42.23,5.3 51.46,5.13 51.2,5.3
DRIVER_OUT1  (via drill 0.3)
  Top 0.48: 51.03,48.59 51.19,49.03
  Top 0.488: v76.96,21.67 76.96,25.32 76.05,26.33 73.28,29.02 73.28,34.31 72.3,35.22 62.78,35.2 60.67,37.27 51.28,46.67 51.03,47.02 51.03,48.59 | RJ45.8 53.84,49.36 51.72,49.37 51.19,49.03
  Bottom 0.48: 76.97,24.25 IC_DRV.7 | R17.2 76.42,20.45 76.97,19.85 76.92,21.68 v76.96,21.67 | 76.96,22.55 76.96,22.06
  Bottom 0.488: 76.97,19.85 76.96,22.55 | 76.96,22.06 76.97,24.25
DRIVER_OUT2  (via drill 0.3)  (1 unrouted)
  Top 0.48: 55.18,47.37 RJ45.7 55.19,47.33
  Top 0.488: v77.85,21.57 77.85,25.58 76.69,26.95 74.16,29.39 74.17,34.68 72.66,36.1 68.4,36.09 63.13,36.09 51.91,47.29 51.92,48.49 55.54,48.49 55.19,47.33
  Bottom 0.48: R17.1 77.85,19.85 v77.86,21.58 v77.85,21.57 | 77.85,24.27 IC_DRV.6
  Bottom 0.488: 77.85,24.27 77.85,19.85
FLIPFLOP_OUT1
  Bottom 0.6: IC_FLIP.6 77.94,32.77 76.68,34.02 76.68,36.42 IC_FLIP.2 | 73.8,25.31 R12.1
  Bottom 1: R12.1 73.83,24.12
  Bottom 1.05: IC_FLIP.6 IC_DRV.3 77.94,26.59 76.74,25.31 73.8,25.31 | 73.83,24.12 R10.2
FLIPFLOP_OUT2
  Bottom 0.6: 74.6,26.58 R13.1
  Bottom 1: 73.81,28.62 R11.2
  Bottom 1.05: IC_FLIP.7 IC_DRV.2 76.67,27.09 76.18,26.58 74.6,26.58 | R13.1 73.81,28.62
GND  (via drill 0.4)
  Top 0.4: C28.2 70.46,12.84 71.01,12.29 71.88,12.29 IC1.6 71.93,12.24 74.61,12.24 74.64,12.27
  Top 0.5: 87.28,11.94 86.98,12.09 85.84,12.78 85.86,12.77 C27.1
  Top 0.6: C27.1 84.86,13.06 IC1.29 | R_P2.1 86.5,18.74 v86.87,18.37
  Top 0.8: C25.1 90.39,6.07 90.55,4.29 90.83,4.09 92.57,4.1 91.9,4.13 | 88.02,23.08 R_P1.1 v89.14,23.43 | C42.- 68.89,3.79 v68.89,1.52 | 74.64,12.27 74.95,11.87 | 74.95,11.87 v74.59,13.55 | 74.95,11.87 v75.44,12.56
  Top 1: 23.5,54.1 23.99,54.1 D4.C | QC1.2 91.2,13.1 90.84,12.98 90.84,12.76 89.74,11.8 | 89.74,11.8 89.74,10.13 89.75,9.94 89.73,9.25 89.84,7.8 90.04,7.13 C25.1 | 89.74,11.8 89.27,11.8 89.05,11.97 87.54,11.97 87.28,11.94 | 91.9,4.13 92.61,4.15 92.71,4.18 92.56,4.04 92.31,3.5 91.07,4.13 92.89,4.15 92.93,2.38 92.94,2.39 92.94,2.2 C41.- | D12.A 68.66,47.29 68.66,47.87 67.35,49.18 D6.A 67.28,49.33 D13.A 67.28,50.83 v68.5,49.61
  Top 1.25: D14.A 60.17,52 v61.45,51.54
  Top 1.4: D8.A 33.34,21.52 L2.1
  Top 2: L1.1 23.5,50.5 23.5,54.1
  layer_gnd 0.6: v86.87,18.37 86.85,18.37 86.47,18.75
  layer_gnd 0.8: v89.14,23.43 89.15,23.45
  layer_gnd 1: v89.99,24.14 91.83,23.87 90.59,23.96 | v96.97,39.56 97.06,39.73 96.79,40 | v84.93,49.97 84.38,49.97 84.11,50.24 83.31,50.24 83.22,50.15 | v94.11,47.82 94.11,46.73 94.05,46.67 | v68.5,49.61 68.5,49.7 68.47,49.73 | v78.05,3.61 v78.06,3.61 78.45,3.22 | 97.76,31.88 97.74,31.89 97.69,31.9
  layer_gnd 1.25: v61.45,51.54 61.6,51.61 60.95,51.43
  layer_gnd 1.5: v77.21,44.09 77.21,42.69
  layer_gnd 2: v70.75,30.92 69.94,30.78 69.64,31.01
  Bottom 0.204: 43.9,15.57 48.14,15.57 C21.+
  Bottom 0.4: IC_R2_OFFS.8 81.86,23.12 C31.2 | IC_CMP.17 84.95,33.6 84.95,33.93 85.71,34.69 85.91,36.15 | R14.1 93.46,38.79 | IC_R2_GAIN.8 92.47,18.02 C29.2 | IC_R2_OFFS.13 85.04,17.44 | 85.04,17.44 IC_R2_OFFS.2 | IC_R2_OFFS.4 83.77,17.29 84.03,17.55 84.93,17.55 85.04,17.44 | IC_R2_GAIN.13 95.64,13.43 95.64,12.21 | 95.64,12.21 IC_R2_GAIN.2 | IC_R2_GAIN.4 94.37,12.26 95.11,12.26 | 95.11,12.26 95.59,12.26 95.64,12.21 | IC_R2_GAIN.3 95,12.15 95.11,12.26 | IC_DRV.5 79.41,23.41 79.49,23.49
  Bottom 0.6: IC_FLIP.5 79.5,31.03 79.44,30.64 79.33,30.49 C10.- | 82.04,37.37 C33.2 81.43,38.59 | 82.03,38.57 82.03,37.15 85.06,37.15 85.19,36.85 86.19,36.87 | 93.42,38.81 R14.1 | 79.89,9.61 80.45,10.17 80.76,10.17
  Bottom 0.63: v89.99,24.14 90.17,24.14 90.94,25.42 91.46,25.4 | 92.18,25.4 91.12,25.41 91.46,25.4 | 91.46,25.4 92.18,25.4 | 92.18,25.4 91.08,24.22 90.61,24.22 92.15,25.24 91,25.07
  Bottom 0.8: C51.2 81.19,6.61 79.91,7.67 79.89,9.61 80.76,10.17 C40.+ | v74.54,12.55 74.59,12.69 74.38,15.06 | 2.12,37.45 2.12,42.79 2.86,43.89 2.86,45.96 C6.2
  Bottom 1: R4.1 R7.1 77.22,42.82 77.23,42.58 | 82.04,37.37 82.03,38.57 | 85.99,35.25 85.91,36.15 85.48,36.92 86.19,36.87 89.89,36.94 90.06,37.67 93.42,37.65 93.42,38.81 | C29.2 90.17,18.19 C38.- | R2.1 91.81,12.47 92.78,13.44 95.63,13.44 95.64,13.43 | C38.- 87.78,20.36 | 87.78,20.36 88.55,19.46 88.53,14.12 89.65,12.54 R2.1 | 90.83,12.48 R2.1 | C26.2 94.56,23.25 93.64,23.24 91.66,23.35 | 91.66,23.35 89.92,22.57 C38.- | 93.97,39 93.79,39 R14.1 | C36.2 93.48,34.74 93.61,33.91 92.98,33.54 | 92.98,33.54 92.56,32.84 | 92.56,32.84 R5.2 91.73,31.69 90.86,30.86 | COLP.2 84.18,28.44 C32.2 81.31,29.46 C10.- 81.22,25.93 C39.- 81.25,24.18 C31.2 | 80.89,23.21 80.92,24.71 v82.24,27.67 | 79.49,23.49 80.73,23.49 80.89,23.21 | 80.89,23.21 80.62,23.34 81.67,23.16 79.7,23.16 79.73,23.18 | 78.14,18.27 78.14,12.63 79.9,11.49 79.98,11.41 80.56,11.41 C40.+ 81.81,10.89 82.78,10.7 84.22,12.73 C30.2 | 87.78,20.36 86.11,20.36 85.41,19.66 | 91.66,23.35 91.72,23.64 v89.99,24.14 | C44.- 96.19,39.51 v96.97,39.56 | C37.- 84.12,51.73 84.07,51.73 84.11,50.75 | 84.11,50.75 84.36,43.63 84.33,45.37 | C43.+ 88.36,53.4 v84.93,49.97 | R29.2 92.8,44.44 93.57,45.21 93.57,47.28 v94.11,47.82 | 94.44,47.6 94.44,47.06 R3.1 | v84.61,50.76 84.12,50.76 84.11,50.75 | 70.01,22.11 70.86,22.73 68.98,24.36 68.98,30.39 70.81,30.29 | PROGRAMMIER_INTERFACE.3 79.25,2.41 v78.05,3.61 | v94.64,34.04 92.83,33.28 92.98,33.54 | v94.03,33.54 93.52,33.48 92.56,32.84 | 2.12,37.45 2.82,37.46 LM1117-5.1_GND 9.09,37.46 C8.- | 5.47,47.29 6.1,47.51 | 6.1,47.51 11.39,47.48 v12.83,45.85 12.88,45.85 13.87,44.86 13.87,43.27 C17.- | C6.2 5.05,45.99 5.15,47.3 6.01,47.28 6.1,47.51
  Bottom 1: v15.25,33.07 13.97,31.6 C16.- 12.93,32.22 12.13,32.22 10.21,34.14 2.98,34.14 2.76,33.92 2.76,33.79 2.58,33.61 C14.2 2.41,32.34 2.41,26.09 3.04,25.46 LM1117-3.3.1_GND 8.43,25.46 C15.-
  Bottom 1.25: C9.- 84.33,45.37 84.48,43.59 | 84.48,43.59 85.41,44.51 88.03,44.51 C45.+ | 84.48,43.59 84.45,43.55 C34.2 C35.2
  Bottom 1.5: v76.31,43.5 76.74,43.33 v77.21,44.09 77.23,43.31 77.33,43.31 77.72,42.92 77.72,42.83 77.12,42.23 77.09,42.69 77.23,42.58 | C44.- 94.03,38.95 93.97,39
  Bottom 2: 70.93,22.55 70.72,21.42 69.54,23.35 71.04,22.73 70.01,22.11 69.44,22.32 C47.- 69.43,19.5 69.43,18.91 69.42,15.03 74.38,15.06 77.48,15.04 77.97,17.81 | C46.- 68.23,32.37 69.23,30.97 | 71.24,30.72 71.52,30.37 71.27,30.12 70.81,30.29 70.99,30.35 70.59,30.75 69.16,30.9 v70.75,30.92
  Bottom 3: v15.25,33.07 16.15,32.94 v16.29,32.88
  Bottom 4: 41.61,15.79 41.82,15.79 42,15.97 43.5,15.97 43.9,15.57 43.9,14.98 44.13,14.75 44.13,14.4 43.66,13.93 43.22,13.93 42.97,13.68 42.45,13.68 41.75,14.38
  other vias: 13.27,44.98 14.2,44.97 13.78,45.87 27.91,25.81 28.89,25.86 28.54,24.18 28.61,25.1 27.79,24.83 29.49,25.09 16.81,33.73 15.89,33.78 17.04,19.66 17.12,20.52 15.85,32.09 17.26,32.99 16.27,20.09 16.84,32.12 77.85,43.55 70.78,29.96 70.09,31.42 83.25,27.71 83.35,26.89 91.28,23.5 90.48,23.47 91.05,24.25 97.49,40.26 97.91,41 97.05,40.96 84.1,50.06 84.77,49.14 85.72,49.57 85.62,50.6 94.84,47.09 95.64,47.02 95.19,46.36 93.29,47.64 93.41,48.43 75.02,11.92 92.94,4.08 91.22,4.09 92.06,4.07 77.71,9.58 80.29,15.52 50.72,33.55 51.58,33.51 52.41,33.54 49.95,33.54 62.57,51.61 63.48,51.66 63.03,50.85 13.32,46.59 14.37,46.49 14.69,45.69 16.27,19.21 17.05,18.67 17.85,20 17.87,19.18 13.15,3.37 13.19,4.33 13.88,3.83 13.92,2.91 13.96,4.7 14.65,3.29 14.72,4.14
  pour layer_gnd (isolate 0.254): -0.1,56.86 111.2,56.6 111.2,-0.1 66.8,0.1 66.75,27.05 65.87,28.47 64.72,29.06 41.22,29.08 41.46,27.68 65.14,27.4 65.3,-0.1 -0.2,-0.2
  pour Bottom (isolate 0.254): 25.26,57.73 25.33,35.62 0.03,35.52 -0.14,57.63
  pour Bottom: 25.97,27.63 65.17,27.43 65.2,-1.3 25.7,-1.1
  pour Bottom (isolate 0.254): -0.19,35.11 24.51,35.11 24.6,23.7 18.4,23.6 16.5,22.2 12.95,22.2 12.98,23.49 12.06,23.49 12.03,22.19 0.6,22.2 -0.5,23.3 -0.5,32.1 -0.2,32.4
  pour Bottom: 17,21.8 18.6,23 24.7,23 24.4,1.6 24.3,-1 0.8,-1 -0.1,-0.1 -0.51,21.77
  pour Top: 110.88,55.86 110.88,2.96 107.15,-0.77 67.76,-0.85 66.88,-0.54 66.65,27.56 64.6,28.86 46.17,29.02 46.19,57.88 57.72,57.93 57.47,51.62 50.72,51.62 49.22,50.23 49.18,45.78 62.09,33.36 70.99,33.52 71.39,32.68 71.41,28.11 74.96,24.54 74.98,20.39 79.09,20.48 79.92,21.43 80.04,21.79 79.94,26.44 76.48,30.56 76.82,35 73.62,38.35 64.53,38.1 63.97,38.02 56.76,45.38 56.94,48.65 58.02,51.34 58.16,57.85 110.22,58.39 110.66,57.95
  pour Bottom (rank 2): 26.21,29.09 65.41,28.99 66.7,27.3 66.96,0.49 68.54,-1.75 104.87,-1.75 112.87,6.25 112.79,50.21 105.41,57.6 58.92,57.1 58.85,52.35 67.69,52.53 67.97,33.33 49.11,33.33 49.04,52.49 57.56,52.3 57.56,57.03 26.33,57.23
  pour Top: 44.99,59.88 44.96,28.93 24.22,29.08 24.45,-0.53 -1.78,-0.53 -2.34,59.71 -1.9,59.71
  pour layer_pwr: 26.2,55.8 109.5,55.8 110.5,54.8 110.5,-0.3 68.52,-0.18 67.72,0.47 67.51,29.83 26.76,29.89 25.7,30 25.7,54.4
GND_VON_DAQ  (via drill 0.4)
  Top 1: 28.5,53.85 27.39,53.85 D4.A | 28.5,50.7 28.16,50.7 L1.4 | v41.81,52.99 42.26,52.99 v42.63,52.62 v41.97,51.96 42.6,52.59 v42.6,53.54
  Top 3: 28.5,50.7 28.5,53.85 C2.- 32.05,53.73 D2.A 45.35,53.73 R16.2 45.24,53.4
  layer_pwr 2: RJ45.P$2 61.46,43.98 59.1,41.59 56.75,41.59 53.87,44.47 51.58,44.47 RJ45.P$1
  Bottom 1: 58.95,49.85 56.43,48.19 56.39,48.15 56.22,48.33 56.43,48.23 55.32,48.93 55.09,49.02 53.93,48.15 51.14,47.99 51.07,47.96
  Bottom 1.25: 58.95,49.85 RJ45.4
  Bottom 3: 42.92,52.73 R16.2 48.5,52.73 51.07,50.16 51.07,47.96 51.07,46.63 51.12,45.33 | 42.92,52.73 42.68,52.73 v42.63,52.62 | v42.93,51.81 42.93,52.72 42.92,52.73 | 51.12,45.33 50.43,44.43 | RJ45.P$1 50.53,43.97 50.35,44.14 50.45,44.26 50.46,44.36 51.12,45.33
LM317_ADJ
  Bottom 1: 7.39,12.76 7.39,13.34 R19.1 7.29,12.03 R20.2 9.76,12.01 D11.A
  Bottom 1.5: LM317.1 5.25,13.46 5.81,12.9 7.25,12.9 7.39,12.76 | D11.A 9.98,8.89 C13.+
N$4
  Top 0.4: IC1.11 71.83,8.18 71.63,8.02
  Top 0.8: 71.63,8.02 PROGRAMMIER_INTERFACE.6
N$5
  Top 0.4: IC1.16 76.91,5.45 75.81,4.35
  Top 0.6: 75.81,4.35 74.78,4.35 74.14,3.71 74.14,2.22 PROGRAMMIER_INTERFACE.5
N$6
  Top 0.4: IC1.17 77.71,5.13 76.77,4.19 76.77,2.25 PROGRAMMIER_INTERFACE.4
N$7
  Top 0.4: IC1.18 78.54,5.56
  Top 0.6: 78.54,5.56 79.23,4.42 D10.3 84.33,3.76 PROGRAMMIER_INTERFACE.1
N$9
  Top 0.3: 60.1,6.37 60.16,6.77
  Top 0.5: 60.16,6.77 59.22,6.78 59.19,6.72 LM2663.2
  Top 1.27: C5.+ 62.19,5.34 60.1,6.37
N$11
  Bottom 0.3: 96.65,11.35 96.45,11.35 IC_R2_GAIN.1
  Bottom 1: 96.65,11.35 96.82,11.33 98.08,11.33 98.07,12 98.17,11.88 R1_GAIN.2
N$12
  Top 0.6: D10.1 85.1,6.69 R1.2
N$16
  Top 0.3: 59.11,9.62 58.66,9.5 LM2663.4
  Top 1.27: C5.- 61.72,10.11 59.11,9.62
N$18
  Bottom 0.4: IC_CMP.11 88.78,33.1 89.16,33.28 89.16,32.38 89.47,32.57 R5.1
N$20
  Bottom 0.4: IC_R2_OFFS.1 86.66,16.36 R1_OFFS.2
N$21
  Top 0.3: LM2663.5 56.15,9.52 53.14,9.28
  Top 1: 56.15,9.52 52.84,9.5 C24.2 54.83,10.51 54.39,10.33
  Top 2: 54.39,10.33 54.18,11 55.95,13.82 58.69,13.64 C19.- | C20.- 60.3,18.18 60.12,18.36 | 54.01,21.63 55.69,21.69 D9.A
  Top 3: C19.- 58.66,13.91 60.12,15.37 60.12,18.36 60.12,20.12 60.27,21.69 54.01,21.63 L3.4
N$23
  Bottom 0.4: IC_CMP.13 87.51,31.97 ROLP.1
  Bottom 1: COLP.1 86.78,31.24 ROLP.1
N$24
  Bottom 1: R6.2 97.67,20.4 C26.1 100.25,21.17 100.05,21.12 SUBD.2
N$25
  Bottom 0.4: IC_CMP.10 88.78,38.64 88.93,38.64 88.91,38.88
  Bottom 0.6: 88.91,38.88 91.04,38.87 R14.2
N$26
  Bottom 0.4: IC_CMP.9 88.14,39.33 88.54,39.68 90.46,39.68 90.46,40.62 93.23,40.63 93.59,40.8 R28.1
  Bottom 1: R28.1 95.59,40.97 R27.2
N$27
  Bottom 0.4: IC_CMP.8 87.52,39.58 88.29,40.33 89.73,40.33 89.73,41.25 91.8,41.27 91.82,42.49 R29.1
  Bottom 1: R29.1 93.61,42.54 R28.2
N$29  (via drill 0.4)
  Top 0.6: 91.45,7.57 QC1.1
  Top 0.8: v92.18,6.18 92.21,7.54 92.37,7.3 91.55,8.45 QC1.1
  Bottom 0.8: C51.1 84.69,6.06 R35.1 84.57,6.97 92.19,6.94 92.22,6.24 v92.18,6.18
OFFSET
  Bottom 0.4: IC_R2_OFFS.14 85.67,22.29 85.71,22.32
  Bottom 0.6: 85.71,22.32 85.72,23.95 88.4,23.96 88.41,27.23 86.92,28.53 ROLP.2
OSC  (via drill 0.4)
  Top 0.6: 73.62,16.42 72.65,17.32
  Top 0.8: v81.19,8.6 80.37,8.53 76.52,8.48 76.55,10.65 76.55,13.44 74.23,16.38 73.62,16.42 | 72.65,17.32 71.48,17.32 70.33,18.47 68.75,20.06 68.76,29.07 68.46,29.75
  Top 1: 56.33,52.49 D14.C | 68.46,29.75 v64.2,33.66 | D14.C 56.39,49.88 RJ45.6 | R_P3.1 56.31,52.59 D14.C
  Bottom 0.8: 81.53,8.33 v81.19,8.6
  Bottom 1: 63.39,45.41 63.29,45.53 63.68,45.58 | R35.2 81.4,8.39 v81.19,8.6
  Bottom 1.25: v64.2,33.66 64.16,37.43 61.35,39.8 61.34,42.26 63.39,45.41 | 63.68,45.58 65.28,46.49 65.28,52.45 64.68,52.89 58.7,52.93 58.63,52.81 56.42,49.94 RJ45.6
OSC_OUT
  Top 0.4: IC1.30 84.36,13.9
  Top 0.55: 84.36,13.9 85.24,14.26
  Top 0.6: 85.24,14.26 86.91,14.36 QC1.3
RX  (via drill 0.4)
  Top 0.6: IC1.1 71.12,16.26 67.71,19.78
  Top 0.8: 67.71,19.78 67.73,28.29 67.54,28.62
  Top 1: 67.54,28.62 v61.94,33.59 | D6.C 63.31,49.59 61.6,49.81 RJ45.2
  Bottom 0.8: 61.51,46.18 61.51,49.72 RJ45.2
  Bottom 1: 61.5,49.91 RJ45.2 | 61.46,46.13 61.51,46.18
  Bottom 1.25: v61.94,33.59 61.9,36.75 59.56,38.63 59.59,43.03 61.46,46.13
SCLK  (via drill 0.4)
  Top 0.4: 79.34,17.17 79.31,17.17 IC1.37
  Top 0.6: v91.78,11.19 93.26,12.27 93.28,15.79 90.78,15.78 90.26,16.2 88.79,17.36 83.24,17.44 | 83.24,17.44 82.95,17.44 81.89,16.38 v80.69,16.38 79.35,16.4 79.36,16.79 79.34,16.82 79.34,17.17 | R_P2.2 83.24,18.66 83.24,17.44
  Bottom 0.2: 92.35,11.19 92.47,11.15 IC_R2_GAIN.7
  Bottom 0.3: IC_R2_OFFS.7 81.63,16.39 81.62,16.38
  Bottom 0.4: v91.77,11.19 v91.78,11.19 91.88,10.99
  Bottom 0.6: 81.62,16.38 v80.69,16.38 | v91.77,11.19 91.78,11.22 91.75,11.19 92.35,11.19
SDH0  (via drill 0.4)
  Top 0.5: 84.35,15.46 83.54,15.49 IC1.32
  Top 0.6: v89.69,15.45 89.17,15.81 85.84,15.83 85.47,15.46 84.35,15.46
  Bottom 0.4: IC_R2_GAIN.10 93.75,15.43 93.12,14.85 90.95,14.85 | 90.95,14.85 90.41,14.85 | R2.2 90.84,14.74 90.95,14.85 | 89.66,15.46 v89.69,15.45
  Bottom 0.6: 90.41,14.85 89.66,15.46
SDH1  (via drill 0.4)
  Top 0.4: v80.54,19.52 80.9,19.49 80.91,18.32 | 80.91,18.32 IC1.35 | IC1.35 80.91,18.32
  Bottom 0.3: 83.14,20.95 83.14,20.92
  Bottom 0.4: IC_R2_OFFS.10 83.14,20.95 | 83.14,20.92 83.11,20.72 82.33,19.94 81.24,19.94 | 81.24,19.94 v80.54,19.52 | 81.35,19.68 81.35,19.83 81.24,19.94
  Bottom 0.6: R15.2 80.45,18.07 81.32,18.94 81.32,19.65 81.35,19.68
SDI  (via drill 0.4)
  Top 0.2: 87.96,20.71 85.68,20.34 85.72,20.56
  Top 0.4: v80.36,20.62 80.21,20.62 | 74.54,18.92 IC1.43
  Top 0.6: 75.28,19.88 74.56,19.16 74.56,19.09 74.54,18.92
  Top 0.8: 80.21,20.62 79.09,19.78 78.99,19.88 75.28,19.88 | v91.39,16.75 87.7,20.55 85.72,20.56 82.48,20.55 81.93,20.62 v80.36,20.62 | R_P1.2 87.96,20.71
  Bottom 0.3: 82.5,21.33 82.51,21.32
  Bottom 0.4: IC_R2_OFFS.9 82.5,21.33 | 82.51,21.32 82.51,21.05 82.08,20.62 v80.36,20.62 | IC_R2_GAIN.9 93.1,15.91 92.86,15.58
  Bottom 0.6: 92.86,15.58 91.39,15.58 v91.39,16.75
SIGIN_FROM_PMT
  Bottom 0.4: IC_CMP.12 88.16,33.01 88.16,32 88.57,31.46 88.57,31.37 R_TERM.2
  Bottom 0.635: 88.61,30.33 88.61,30.75 arc-90 R_TERM.2 | SUBD.COAX 100.3,27.88 | 92.09,27.63 92.09,27.64
  Bottom 0.669: 92.09,27.64 91.3,27.64 arc-90 88.61,30.33 | 100.3,27.88 arc-90 98.56,26.14 96.5,26.14 arc-36 94.81,27.12 arc48 93.67,27.63 92.09,27.63
  Bottom 1: 100.28,27.91 100.27,27.96 SUBD.COAX
SUPPLY_5.3V
  Top 1: D7.C 33.28,4.7
  Top 1.778: 33.28,4.7 L2.2
  Bottom 0.5: 6.38,16 6.63,16 R19.2 9.83,15.34 D11.C
  Bottom 1.778: C7.+ 33.34,7.67 33.34,8 L2.2
  Bottom 2: 19.95,11.55 20.46,10.97 C12.+ | D5.A 15.01,16.2 20.35,11.13 | LM317.2 6.38,16 6.71,16.33
  Bottom 3: 14.65,16.34 16.02,15.98 | 16.02,15.98 20.35,11.13 20.08,11.31 19.95,11.55 20.37,10.9 21.68,9.16 21.68,5.36 22.9,2.1 28.9,2.1 28.9,7.6 29.2,7.9 33.23,7.9 33.34,8 | 6.71,16.33 15.35,16.29 16.02,15.98
TEST-LED-ANODE
  Top 0.8: 57.87,53.99 57.89,51 57.72,50.6 RJ45.5 | D13.C 67.49,54.78
  Top 1.2: 93.54,41.79 96,38.54 100.21,37.61 98.66,37.94 SUBD.6
  Top 1.25: 93.54,41.79 90.73,48.08 90.75,48.18 90.73,51.79 87.79,54.79 67.49,54.78 65.31,54.78 59.49,54.78 57.87,53.99
TX  (via drill 0.4)
  Top 0.6: IC1.44 73.71,20.88 | 69.79,29.2 69.76,29.2
  Top 0.8: 73.71,20.88 69.79,24.5 69.79,29.2 | 69.76,29.2 69.72,30.14 66.16,33.58 v66.09,33.63
  Top 1: v69.11,44.52 68.37,44.52 67.3,45.59 67.3,46.46 66.77,46.99 65.87,46.99 | 65.87,46.99 63.35,46.99 RJ45.1 | D12.C 65.75,46.87 65.87,46.99
  Bottom 1: v66.09,33.63 66,36.25 65.97,38.01 66.39,38.97 67.79,41.97 68.19,42.82 v69.11,44.52
VCONTROL
  Bottom 0.4: IC_R2_GAIN.14 96.28,18.04 R6.1
VREFOUT
  Bottom 1: R1_GAIN.1 99.16,15.54 99.58,15.49
  Bottom 2: 99.58,15.49 102.82,15.49 102.85,19.75 SUBD.7

## Text on the board
Top: v1.0, 01.01.2007, hll | TOP, MPI-Met PMT-Head, v2.4, 13.01.2016, dah
Bottom: v1.0, 01.01.2007, hll | BOT, MPI-Met PMT-Head, v2.4, 13.01.2016, dah
tNames: MPI-Met PMT-Head, / v2.4, 13.01.2016, dah | 6 | 1
bNames: 0.5 20% | 0.5 10% | 0.6 20% | 0.6 10% | 0.7 20% | 0.7 10% | 0.8 20% | 0.8 10% | 0.9 10% | 1.0 10% | 1.5 10% | 2 10%
201bmp: /home/dah/Daten/Eagle/PMT/Prototyp1/PCB.bmp